# Altium schematic sheet SH3 - USB.SchDoc
size Letter; Organization: UW Robotics; Address1: 200 University Avenue; Address2: Waterloo; Address3: Ontario; Address4: Canada N2L 3G6
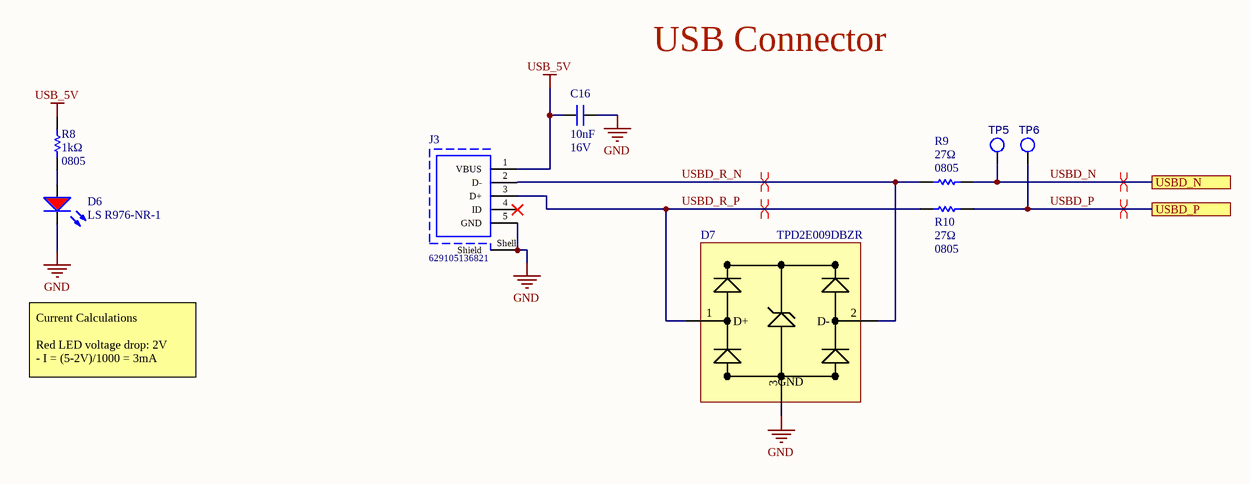
[diagram p0: SH3 - USB.SchDoc]

## Parts
C16  Voltage Rating: 16V  Capacitance: 10nF  [CAP2012]  (hidden comment: CAP_10nF_16V_0805)
D6  LS R976-NR-1  [LED_0805_RED]
D7  Manufacturer Part Number: TPD2E009DBZR  [SOT23-3]  (hidden comment: TVS_DIODE_USB_5.5V)
J3  629105136821  [629105136821]
R8  Resistance: 1kΩ  Case Code (Imperial): 0805  [RESC0805]  (hidden comment: RES_1kΩ_0805_1%)
R9  Resistance: 27Ω  Case/Package: 0805  [RESC0805]  (hidden comment: RES_27Ω_0805)
R10  Resistance: 27Ω  Case/Package: 0805  [RESC0805]  (hidden comment: RES_27Ω_0805)
TP5  TESTPOINT_LOOP  [TESTPOINT_LOOP]  (value not drawn)
TP6  TESTPOINT_LOOP  [TESTPOINT_LOOP]  (value not drawn)

## Ports
USBD_N, USBD_P

## Nets
GND: C16.2 D6.2(K) D7.3(GND) J3.5(GND) J3.Shell(Shield)
USB_5V: C16.1 J3.1(VBUS) R8.2
USBD_N: R9.2 TP5.1 ; port USBD_N
USBD_P: R10.2 TP6.1 ; port USBD_P
USBD_R_N: D7.2(D-) J3.2(D-) R9.1
USBD_R_P: D7.1(D+) J3.3(D+) R10.1
NetD6_1: D6.1(A) R8.1

Not connected (* = marked no-connect by the designer): J3 4(ID)*

## Layout directives
differential pair: USBD_N, USBD_P, USBD_R_N, USBD_R_P

## Notes on the sheet
- USB Connector
- Current Calculations
  Red LED voltage drop: 2V
  - I = (5-2V)/1000 = 3mA
- Title
- Size:
- Date:
- Letter
- Drawn By:
- Sheet
- of
- File:

## Library data of the parts
C16 = CAP_10nF_16V_0805: CAP CER 10000PF 16V X7R 0805; Manufacturer 1: Yageo; Manufacturer Part Number 1: AC0805KRX7R7BB103; Tolerance: 10%; Supplier 1: Digi-Key; Mount: Surface Mount; Case Code (Imperial): 0805; Supplier Part Number 1: 311-3161-1-ND; Stock 1: 14344; Pricing 1: 1=0.20000, 10=0.13900, 100=0.07060, 500=0.04832, 1000=0.04275 (USD); RoHS: No; Case/Package: 0805; Case Code (Metric): 2012; Min Operating Temperature: -55°C; Max Operating Temperature: 125°C; Packaging: Cut Tape; Ratings: AEC-Q200; ComponentLink1URL: http://www.yageo.com/NewPortal/_en/search/productDocs.jsp?YageoPartNumber=AC0805KRX7R7BB103&src-supplier=Digi-Key; ComponentLink1Description: http://www.yageo.com/NewPortal/_en/search/productDocs.jsp?YageoPartNumber=AC0805KRX7R7BB103&src-supplier=Digi-Key
D6 = DIO_LED_R: LED RED DIFFUSED 0805 SMD; Manufacturer 1: OSRAM; Forward Voltage Drop: 2V; Package: 0805 (2012 Metric); Manufacturer Part Number 1: LS R976-NR-1; Supplier Part Number 1: 475-1278-1-ND; Supplier 1: Digi-Key; Mount: Surface Mount
D7 = TVS_DIODE_USB_5.5V: ESD Suppressor Diode Arrays 8KV 3-Pin SOT-23 T/R; Manufacturer: Texas Instruments; Direction: Unidirectional; Operating Supply Voltage: 6V; Capacitance: 0.9pF; Number of Channels: 2; Current Rating: 100nA; Peak Pulse Current: 1A; Element Configuration: Dual; Reverse Standoff Voltage: 5.5V; Min Breakdown Voltage: 9V; Clamping Voltage: 8V; Peak Pulse Power: 45W; Power Line Protection: Yes; Breakdown Voltage: 7V; Interface: LVDS,PCIe,SATA; Supplier 1: Digi-Key; RoHS: Yes; Category: Interface ICs; Stock 1: 98615; Pricing 1: 1=0.56000, 10=0.48000, 25=0.44800, 100=0.33280, 250=0.31616, 500=0.25984, 1000=0.21120 (USD); Case/Package: SOT-23; Number of Pins: 3; Min Operating Temperature: -40°C; Max Operating Temperature: 85°C; Packaging: Tape and Reel; Package Quantity: 1; Number of Bidirectional Channels: 2; Termination: SMD/SMT; Max Power Dissipation: 45W; Working Voltage: 5.5V; Length: 2.92mm; Height: 1mm; Width: 1.3mm; Depth: 1.3mm; Radiation Hardening: No; REACH SVHC: No SVHC; Lead Free: Lead Free; ComponentLink1URL: https://datasheet.ciiva.com/353/tpd2e009-353266.pdf?src-supplier=Digi-Key; ComponentLink1Description: https://datasheet.ciiva.com/353/tpd2e009-353266.pdf?src-supplier=Digi-Key; ComponentLink2URL: https://datasheet.ciiva.com/15134/getdatasheetpartid-243395-15134537.pdf?src-supplier=Verical; ComponentLink2Description: https://datasheet.ciiva.com/15134/getdatasheetpartid-243395-15134537.pdf?src-supplier=Verical; ComponentLink3URL: https://datasheet.ciiva.com/4479/slvs953a-121037-4479453.pdf?src-supplier=Mouser; ComponentLink3Description: https://datasheet.ciiva.com/4479/slvs953a-121037-4479453.pdf?src-supplier=Mouser; ComponentLink4URL: https://datasheet.ciiva.com/353/tpd2e009-353268.pdf?src-supplier=Digi-Key; ComponentLink4Description: https://datasheet.ciiva.com/353/tpd2e009-353268.pdf?src-supplier=Digi-Key; ComponentLink5URL: https://datasheet.ciiva.com/353/tpd2e009-353267.pdf?src-supplier=Digi-Key; ComponentLink5Description: https://datasheet.ciiva.com/353/tpd2e009-353267.pdf?src-supplier=Digi-Key; ComponentLink6URL: https://datasheet.ciiva.com/46384/1707898-46384524.pdf?src-supplier=Element14; ComponentLink6Description: https://datasheet.ciiva.com/46384/1707898-46384524.pdf?src-supplier=Element14; Supplier Part Number 1: 296-24657-1-ND
J3 = CMP-1502-03253-1: Micro USB 2.0 Type B Receptacle WR-COM, Horizontal, SMT, with Pads and Pegs; Manufacturer: Wurth Elektronik; Contact Resistance: 30mOhm; Rated Current: 1A; Working Voltage: 30VAC; Datasheet URL: https://katalog.we-online.de/em/datasheet/629105136821.pdf; Mounting Technology: SMT; Publisher: WurthElektronik; Package Reference: 629105136821; Orientation: Horizontal; Packaging: TapeandReel; Part Number: 629105136821; Manufacturer URL: http://www.we-online.de; Connector Type: MicroUSB2.0TypeB; Gender: Receptacle; Operating Temperature: -40to105degC
R8 = RES_1kΩ_0805_1%: RES 1K OHM 1% 1/8W 0805; Manufacturer 1: Yageo; Manufacturer Part Number 1: RC0805FR-071KL; Power Rating: 125mW; Temperature Coefficient: 25ppm/°C; Voltage Rating: 150V; Supplier 1: Digi-Key; Case Code (Metric): 2012; Min Operating Temperature: -55°C; Max Operating Temperature: 155°C; Tolerance: 1%; Termination: SMD/SMT; Supplier Part Number 1: 311-1.00KCRCT-ND; Package: 0805 (2012 Metric); Mount: Surface Mount; Case/Package: 0805; Number of Pins: 2; Weight: 0.000194oz; Contact Plating: Tin; Composition: Thin Film; Number of Terminations: 2; Voltage Rating (DC): 150V; Max Power Dissipation: 125mW; Features: Moisture Resistant,Automotive AEC-Q200,Anti-Sulfur; Military Standard: Not; Length: 2mm; Height: 0.022inch; Width: 0.049inch; Depth: 1.25mm; REACH SVHC: Unknown
R9 R10 = RES_27Ω_0805_1%: RES 27 OHM 1% 1/8W 0805; Manufacturer Part Number 1: RC0805FR-0727RL; Manufacturer 1: Yageo; Temperature Coefficient: 100ppm/°C; Power Rating: 125mW; Voltage Rating: 150V; Supplier 1: Digi-Key; Case Code (Imperial): 0805; Case Code (Metric): 2012; Min Operating Temperature: -55°C; Max Operating Temperature: 155°C; Tolerance: 1%; Composition: Thick Film; Termination: SMD/SMT; Military Standard: Not; Length: 2mm; Width: 1.25mm; Depth: 1.25mm; REACH SVHC: Unknown; Supplier Part Number 1: 311-27.0CRCT-ND; Working Voltage: 150V; Number of Terminations: 2; Height: 0.5mm
TP5 TP6 = TESTPOINT_LOOP: Loop testpoint through-hole pad; Manufacturer Part Number 1: 5002; Manufacturer 1: Keystone Electronics; Supplier Part Number 1: 36-5002-ND; Supplier 1: Digi-Key; Mount: Through Hole